# EAGLE design REF-IN-BLE-NS 4-1 (EAGLE 7.7.0)
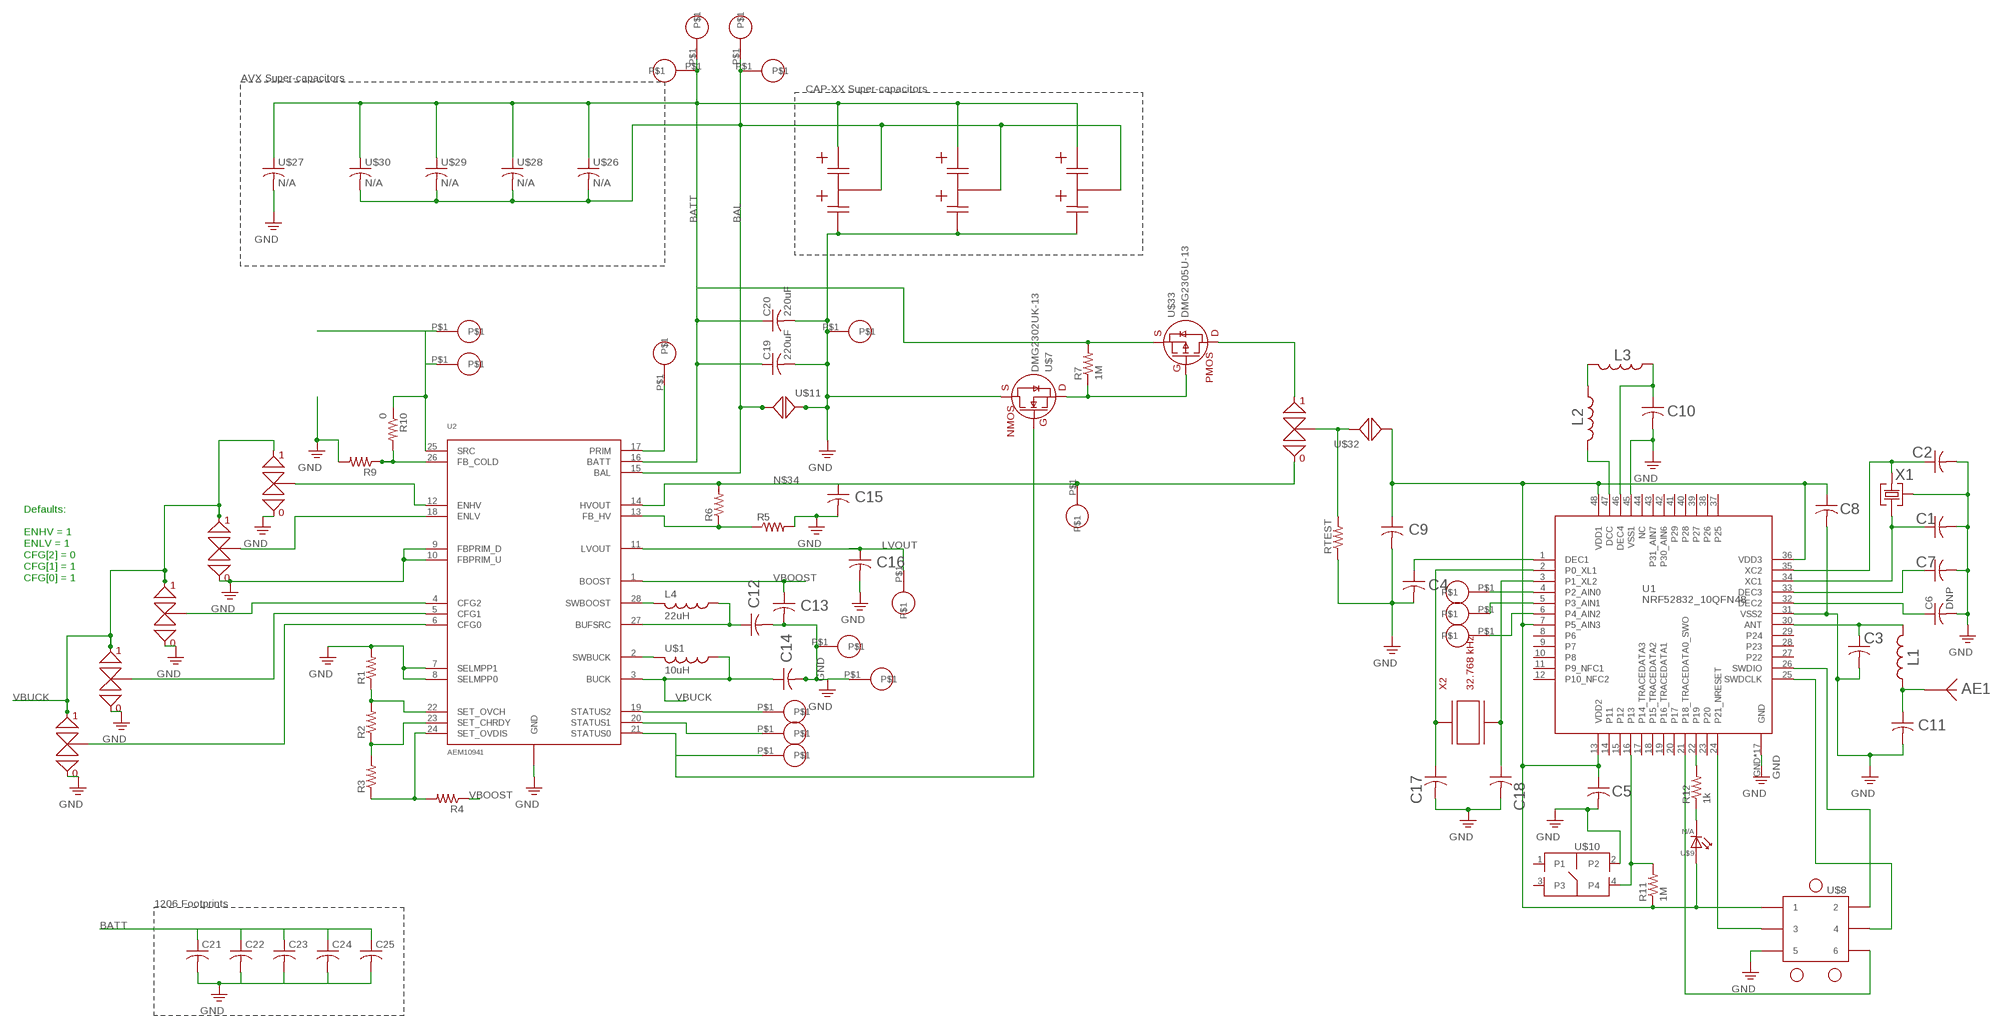
[diagram p0: schematic, sheet 1]

## Parts
AE1  N/A  2.4GHZ_ANTENNA  [BLE_ANTENNA_NORDIC]
C1  12pF  C-UST-12PFC0603  [C0603]
C2  12pF  C-UST-12PFC0603  [C0603]
C3  0.8pF  C-UST-0.8PFC0603  [C0603]
C4  100nF  C-UST-100NFC0603  [C0603]
C5  100nF  C-UST-100NFC0603  [C0603]
C6  DNP  C-USC0603  [C0603]
C7  100pF  C-UST-100PFC0603  [C0603]
C8  100nF  C-UST-100NFC0603  [C0603]
C9  4.7uF  C-UST-4.7UFC0603  [C0603]
C10  1uF  C-UST-1UFC0603  [C0603]
C11  DNP  C-USC0603  [C0603]
C12  10uF  C-UST-10UFC0603  [C0603]
C13  22uF  C-UST-22UFC0603  [C0603]
C14  10uF  C-UST-10UFC0603  [C0603]
C15  10uF  C-UST-10UFC0603  [C0603]
C16  10uF  C-UST-10UFC0603  [C0603]
C17  12pF  C-UST-12PFC0603  [C0603]
C18  12pF  C-UST-12PFC0603  [C0603]
C19  220uF  C-UST-220UFC1206  [C1206]
C20  220uF  C-UST-220UFC1206  [C1206]
C21  C-USC1206  [C1206]
C22  C-USC1206  [C1206]
C23  C-USC1206  [C1206]
C24  C-USC1206  [C1206]
C25  C-USC1206  [C1206]
L1  3.9nH  L0603V-3.9NH  [L0603]
L2  10uH  L0603V-10UH  [L0603]
L3  15nH  L0603V-15NH  [L0603]
L4  22uH  744031220  [744031220]
R1  R-US_R0603  [R0603]
R2  R-US_R0603  [R0603]
R3  R-US_R0603  [R0603]
R4  R-US_R0603  [R0603]
R5  R-US_R0603  [R0603]
R6  R-US_R0603  [R0603]
R7  1M  R-US_R0603  [R0603]
R9  R-US_R0603  [R0603]
R10  0  R-US_R0603  [R0603]
R11  1M  R-US_R0603  [R0603]
R12  1k  R-US_R0603  [R0603]
RTEST  R-US_R0603  [R0603]
U1  NRF52832_10QFN48  [NRF52832_10]
U2  AEM10941  [QFN28_5X5_05PITCH]
U$1  10uH  L0603V-10UH  [L0603]
U$2  DOUBLE_SOLDER_BRIDGE1_CLOSED  [DOUBLE_SOLDER_BRIDGE_1_CLOSED]
U$3  DOUBLE_SOLDER_BRIDGE1_CLOSED  [DOUBLE_SOLDER_BRIDGE_1_CLOSED]
U$4  N/A  DOUBLE_SOLDER_BRIDGE0_CLOSED  [DOUBLE_SOLDER_BRIDGE_0_CLOSED]
U$5  DOUBLE_SOLDER_BRIDGE1_CLOSED  [DOUBLE_SOLDER_BRIDGE_1_CLOSED]
U$6  DOUBLE_SOLDER_BRIDGE1_CLOSED  [DOUBLE_SOLDER_BRIDGE_1_CLOSED]
U$7  DMG2302UK-13  [SOT-23-3-DIODESINC]
U$8  N/A  TC2030-IDC  [TC2030-IDC]
U$9  N/A  APT1608LZGCK  [APT1608LZGCK]
U$10  MJTP1140  [MJTP1140A]
U$11  SOLDER_BRIGDECLOSED  [SOLDER_BRIDGE_CLOSED]
U$12  N/A  1MM_PAD  [1MM_PAD]
U$13  N/A  1MM_PAD  [1MM_PAD]
U$14  N/A  1MM_PAD  [1MM_PAD]
U$15  N/A  1MM_PAD  [1MM_PAD]
U$16  N/A  1MM_PAD  [1MM_PAD]
U$17  N/A  1MM_PAD  [1MM_PAD]
U$18  N/A  1MM_PAD  [1MM_PAD]
U$19  N/A  1MM_PAD  [1MM_PAD]
U$20  N/A  1MM_PAD  [1MM_PAD]
U$21  N/A  1MM_PAD  [1MM_PAD]
U$22  N/A  1MM_PAD  [1MM_PAD]
U$23  N/A  CAP-XX_A-TYPE  [CAP-XX_A-TYPE]
U$24  N/A  CAP-XX_S-TYPE  [CAP-XX_S-TYPE]
U$25  N/A  CAP-XX_W-TYPE  [CAP-XX_W-TYPE]
U$26  N/A  BZ01_L-TYPE  [BZ01_L-TYPE]
U$27  N/A  BZ059_N-TYPE  [BZ059_N-TYPE]
U$28  N/A  BZ01_S-TYPE  [BZ01_S-TYPE]
U$29  N/A  BZ05_S-TYPE  [BZ05_S-TYPE]
U$30  N/A  BZ09_S-TYPE  [BZ09_S-TYPE]
U$31  DOUBLE_SOLDER_BRIDGE1_CLOSED  [DOUBLE_SOLDER_BRIDGE_1_CLOSED]
U$32  SOLDER_BRIGDECLOSED  [SOLDER_BRIDGE_CLOSED]
U$33  DMG2305U-13  [SOT-23-3-DIODESINC]
U$35  N/A  1MM_PAD  [1MM_PAD]
U$36  N/A  1MM_PAD  [1MM_PAD]
U$37  N/A  1MM_PAD  [1MM_PAD]
U$38  N/A  1MM_PAD  [1MM_PAD]
U$39  N/A  1MM_PAD  [1MM_PAD]
U$40  N/A  1MM_PAD  [1MM_PAD]
U$41  N/A  1MM_PAD  [1MM_PAD]
X1  32 MHz  FA-128-32MHZMF10Z-AJ5  [FA-128-EPSON]
X2  32.768 kHz  FC-135_32.7680KA-AC  [FC-135]

## Nets
BAL: U2.15(BAL) U$11.P$1(P1) U$19.P$1 U$23.P$1(BAL) U$24.P$1(BAL) U$25.P$1(BAL) U$26.P$3 U$26.P$4 U$28.P$3 U$29.P$3 U$30.P$3 U$41.P$1
BATT: C19.1 C20.1 C21.1 C22.1 C23.1 C24.1 C25.1 R7.2 U2.16(BATT) U$18.P$1 U$23.P$2(+) U$24.P$2(+) U$25.P$2(+) U$26.P$1 U$26.P$2 U$27.P$1 U$28.P$1 U$28.P$2 U$29.P$1 U$29.P$2 U$30.P$1 U$30.P$2 U$33.2(S) U$40.P$1
GND: C1.2 C2.2 C3.2 C4.2 C5.2 C6.2 C7.2 C8.2 C9.2 C10.2 C11.2 C12.2 C13.2 C14.2 C15.2 C16.2 C17.2 C18.2 C19.2 C20.2 C21.2 C22.2 C23.2 C24.2 C25.2 R1.2 R5.2 R9.2 RTEST.1 U1.31(VSS2) U1.45(VSS1) U1.GND U1.P$2(GND) U1.P$3(GND) U1.P$4(GND) U1.P$5(GND) U1.P$6(GND) U1.P$7(GND) U1.P$8(GND) U1.P$9(GND) U1.P$10(GND) U1.P$11(GND) U1.P$12(GND) U1.P$13(GND) U1.P$14(GND) U1.P$15(GND) U1.P$16(GND) U1.P$17(GND) U2.7(SELMPP1) U2.8(SELMPP0) U2.9(FBPRIM_D) U2.10(FBPRIM_U) U2.GND U2.GND1(GND) U2.GND2(GND) U2.GND3(GND) U2.GND4(GND) U2.GND5(GND) U$2.IN0 U$3.IN0 U$4.IN0 U$5.IN0 U$6.IN0 U$7.2(S) U$8.P5 U$10.2 U$11.P$2(P2) U$17.P$1 U$23.P$3(-) U$24.P$3(-) U$25.P$3(-) U$27.P$2 U$35.P$1 U$38.P$1 X1.P2(P3) X1.P4(P3)
HVOUT: C5.1 C8.1 C9.1 R11.1 U1.7(P5_AIN3) U1.13(VDD2) U1.36(VDD3) U1.48(VDD1) U$8.P1 U$9.A U$32.P$1(P1)
LVOUT: C16.1 U2.11(LVOUT) U$16.P$1
N$1: L2.2 U1.47(DCC)
N$2: L2.1 L3.2
N$3: C10.1 L3.1 U1.46(DEC4)
N$5: C4.1 U1.1(DEC1)
N$6: C2.1 U1.35(XC2) X1.P1
N$7: C1.1 U1.34(XC1) X1.P3
N$8: C3.1 L1.2 U1.30(ANT)
N$9: AE1.P$1 C11.1 L1.1
N$10: C7.1 U1.33(DEC3)
N$11: C6.1 U1.32(DEC2)
N$12: L4.PIN2 U2.28(SWBOOST)
N$13: C12.1 L4.PIN1 U2.27(BUFSRC)
N$14: R1.1 R2.2 U2.22(SET_OVCH)
N$15: U2.2(SWBUCK) U$1.2
N$16: R2.1 R3.2 U2.23(SET_CHRDY)
N$17: R11.2 U1.16(P13) U$10.4
N$18: R3.1 R4.2 U2.24(SET_OVDIS)
N$19: U2.4(CFG2) U$4.OUT
N$20: U2.18(ENLV) U$3.OUT
N$21: U1.25(SWDCLK) U$8.P4
N$22: U1.24(P21_NRESET) U$8.P3
N$23: U2.12(ENHV) U$2.OUT
N$24: U1.26(SWDIO) U$8.P2
N$25: U1.21(P18_TRACEDATA0_SWO) U$8.P6
N$26: U2.5(CFG1) U$5.OUT
N$27: U2.6(CFG0) U$6.OUT
N$28: R5.1 R6.1 U2.13(FB_HV)
N$29: R10.1 U2.25(SRC) U$36.P$1 U$39.P$1
N$30: R12.1 U$9.C
N$31: R12.2 U1.22(P19)
N$32: R9.1 R10.2 U2.26(FB_COLD)
N$34: C15.1 R6.2 U2.14(HVOUT) U$31.IN0 U$37.P$1
N$36: C17.1 U1.2(P0_XL1) X2.P$1
N$37: C18.1 U1.3(P1_XL2) X2.P$2
N$38: U1.4(P2_AIN0) U$20.P$1
N$42: U1.5(P3_AIN1) U$21.P$1
N$43: U1.6(P4_AIN2) U$22.P$1
N$45: RTEST.2 U$31.OUT U$32.P$2(P2)
N$46: U$31.IN1 U$33.3(D)
N$47: R7.1 U$7.3(D) U$33.1(G)
PRIM: U2.17(PRIM) U$12.P$1
STATUS0: U2.21(STATUS0) U$7.1(G) U$15.P$1
STATUS1: U2.20(STATUS1) U$14.P$1
STATUS2: U2.19(STATUS2) U$13.P$1
VBOOST: C13.1 R4.1 U2.1(BOOST)
VBUCK: C14.1 U2.3(BUCK) U$1.1 U$2.IN1 U$3.IN1 U$4.IN1 U$5.IN1 U$6.IN1
Unconnected: U1.8(P6) U1.9(P7) U1.10(P8) U1.11(P9_NFC1) U1.12(P10_NFC2) U1.14(P11) U1.15(P12) U1.17(P14_TRACEDATA3) U1.18(P15_TRACEDATA2) U1.19(P16_TRACEDATA1) U1.20(P17) U1.23(P20) U1.27(P22) U1.28(P23) U1.29(P24) U1.37(P25) U1.38(P26) U1.39(P27) U1.40(P28) U1.41(P29) U1.42(P30_AIN6) U1.43(P31_AIN7) U1.44(NC) U$10.1 U$10.3

## Notes on the sheet
- AVX Super-capacitors
- CAP-XX Super-capacitors
- Defaults:
  
  ENHV = 1
  ENLV = 1
  CFG[2] = 0
  CFG[1] = 1
  CFG[0] = 1
- 1206 Footprints

## Library data of the parts
AE1 = 00_PF_Nordic:2.4GHZ_ANTENNA; MFG_PART#: N/A; PERCENTAGE: N/A
C1 C2 C17 C18 = resistor:C-US: CAPACITOR, American symbol; MFG_PART#: C0603C120J5GACTU; PERCENTAGE: 5%
C3 = resistor:C-US: CAPACITOR, American symbol; MFG_PART#: CBR06C808B5GAC; PERCENTAGE: 5%
C4 C5 C8 = resistor:C-US: CAPACITOR, American symbol; MFG_PART#: CL10B104KB8NNNC; PERCENTAGE: 10%
C6 C11 C21-C25 = resistor:C-US: CAPACITOR, American symbol
C7 = resistor:C-US: CAPACITOR, American symbol; MFG_PART#: CL10C101JB8NNNC; PERCENTAGE: 5%
C9 = resistor:C-US: CAPACITOR, American symbol; MFG_PART#: CL10A475KQ8NNWC; PERCENTAGE: 5%
C10 = resistor:C-US: CAPACITOR, American symbol; MFG_PART#: CL10A105KP8NNNC; PERCENTAGE: 10%
C12 C14-C16 = resistor:C-US: CAPACITOR, American symbol; MFG_PART#: GRM188R61E106MA73D; PERCENTAGE: 20%
C13 = resistor:C-US: CAPACITOR, American symbol; MFG_PART#: GRM188R61A226ME15D; PERCENTAGE: 20%
C19 C20 = resistor:C-US: CAPACITOR, American symbol; MFG_PART#: GRM31CC80G227ME11L
L1 = 00_PF_Nordic:L0603; MFG_PART#: L-14C3N9SV4T; PERCENTAGE: 5%
L2 U$1 = 00_PF_Nordic:L0603; MFG_PART#: LBR2012T100M; PERCENTAGE: 20%
L3 = 00_PF_Nordic:L0603; MFG_PART#: L-14C15NJV4T; PERCENTAGE: 10%
L4 = 00_PF_Nordic:744031220: Wurth inductor 22uH; MFG_PART#: 744031220; PERCENTAGE: 30%
R1-R7 R9-R12 RTEST = resistor:R-US_: RESISTOR, American symbol
U1 = 00_PF_Nordic:NRF52832_10QFN48; MFG_PART#: NRF52832-QFAA-R
U2 = 00_PF_Nordic:AEM10941: AEM10941 ? Energy Harvesting Power Management IC; MFG_PART#: AEM10941-QFN
U$2 U$3 U$5 U$6 U$31 = 00_PF_Nordic:DOUBLE_SOLDER_BRIDGE
U$4 = 00_PF_Nordic:DOUBLE_SOLDER_BRIDGE; MFG_PART#: N/A; PERCENTAGE: N/A
U$7 = 00_PF_Nordic:DMG2302UK-13
U$8 = 00_PF_Nordic:TC2030-IDC; MFG_PART#: N/A; PERCENTAGE: N/A
U$9 = 00_PF_Nordic:APT1608LZGCK; MFG_PART#: APT1608LZGCK; PERCENTAGE: N/A
U$10 = 00_PF_Nordic:MJTP1140; MFG_PART#: TL3315NF100Q
U$11 U$32 = 00_PF_Nordic:SOLDER_BRIGDE
U$12-U$22 U$35-U$41 = 00_PF_Nordic:1MM_PAD; MFG_PART#: N/A; PERCENTAGE: N/A
U$23 = 00_PF_Nordic:CAP-XX_A-TYPE; MFG_PART#: N/A; PERCENTAGE: N/A
U$24 = 00_PF_Nordic:CAP-XX_S-TYPE; MFG_PART#: N/A; PERCENTAGE: N/A
U$25 = 00_PF_Nordic:CAP-XX_W-TYPE; MFG_PART#: N/A; PERCENTAGE: N/A
U$26 = 00_PF_Nordic:BZ01_L-TYPE; MFG_PART#: N/A; PERCENTAGE: N/A
U$27 = 00_PF_Nordic:BZ059_N-TYPE; MFG_PART#: N/A; PERCENTAGE: N/A
U$28 = 00_PF_Nordic:BZ01_S-TYPE; MFG_PART#: N/A; PERCENTAGE: N/A
U$29 = 00_PF_Nordic:BZ05_S-TYPE; MFG_PART#: N/A; PERCENTAGE: N/A
U$30 = 00_PF_Nordic:BZ09_S-TYPE; MFG_PART#: N/A; PERCENTAGE: N/A
U$33 = 00_PF_Nordic:DMG2305U-13
X1 = 00_PF_Nordic:FA-128-32MHZMF10Z-AJ5; MFG_PART#: FA-128 32.0000MF10Z-AJ3; PERCENTAGE: 10 ppm
X2 = 00_PF_Nordic:FC-135_32.7680KA-AC; MFG_PART#: FC-135 32.7680KA-AC

## Board
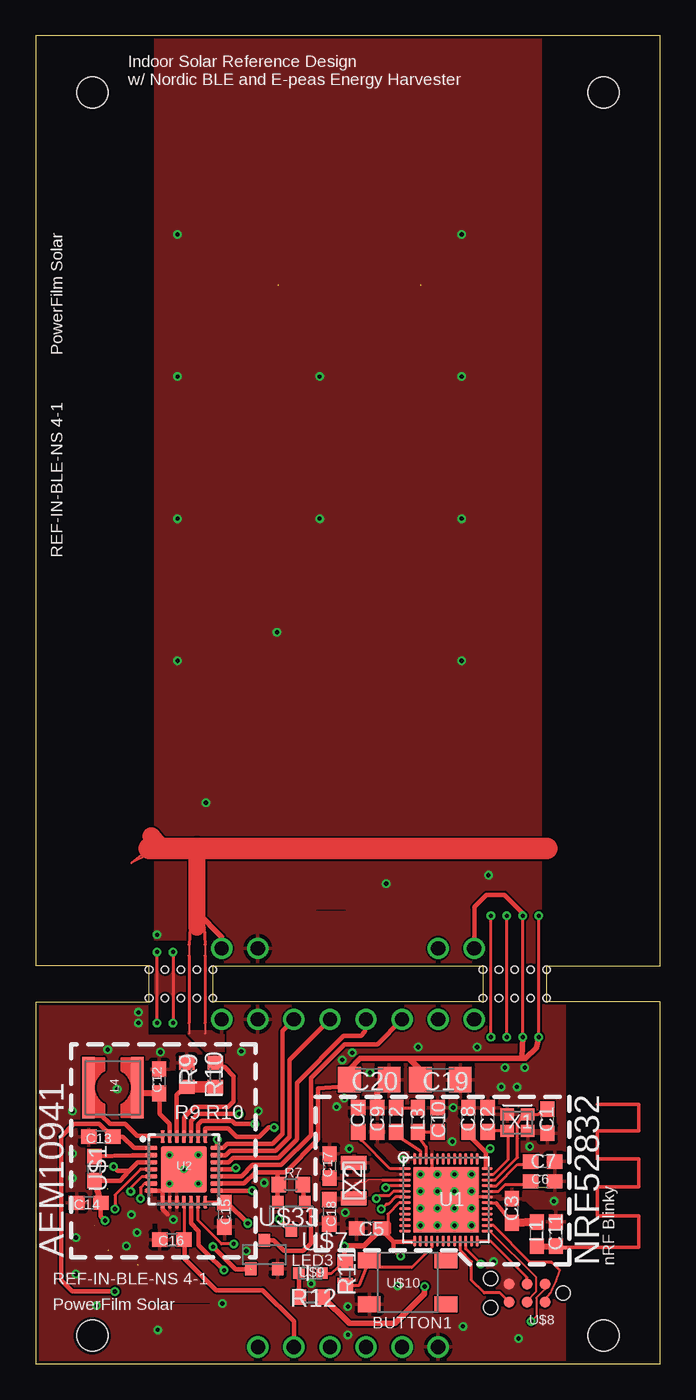
[diagram p1: board, top side]
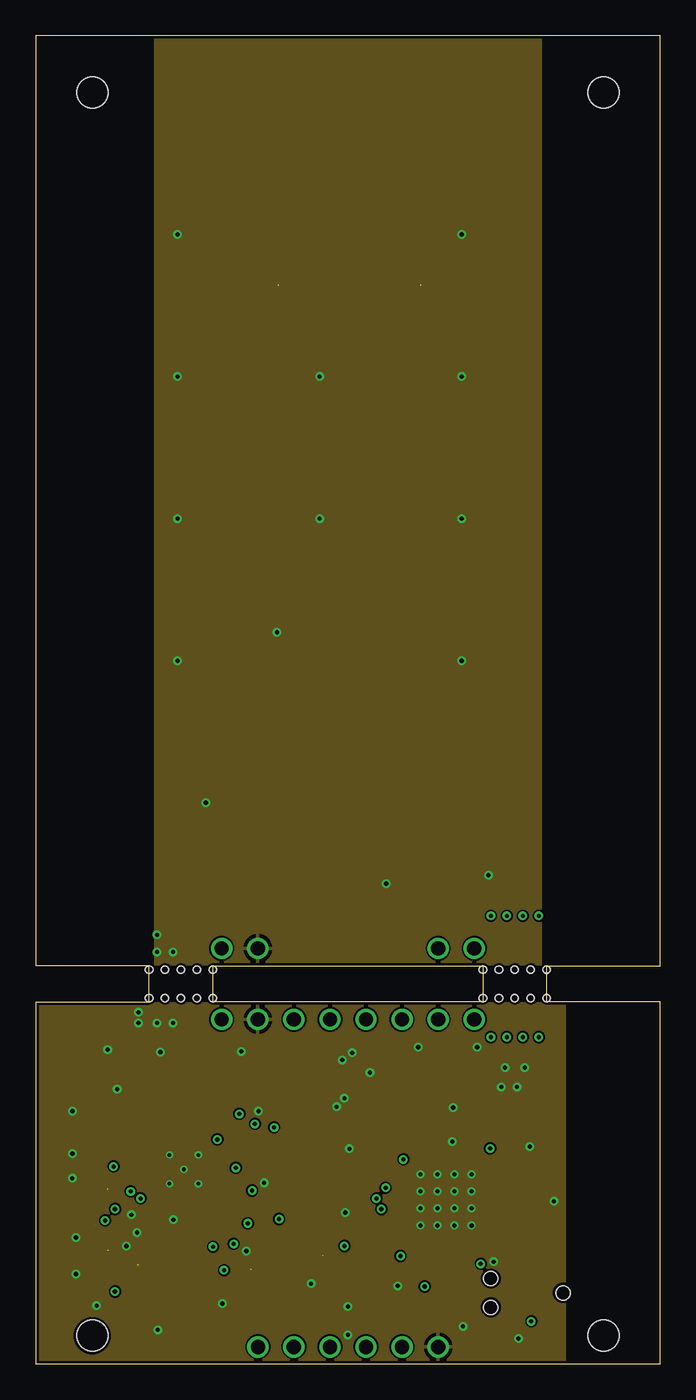
[diagram p2: board, inner layer Route2]
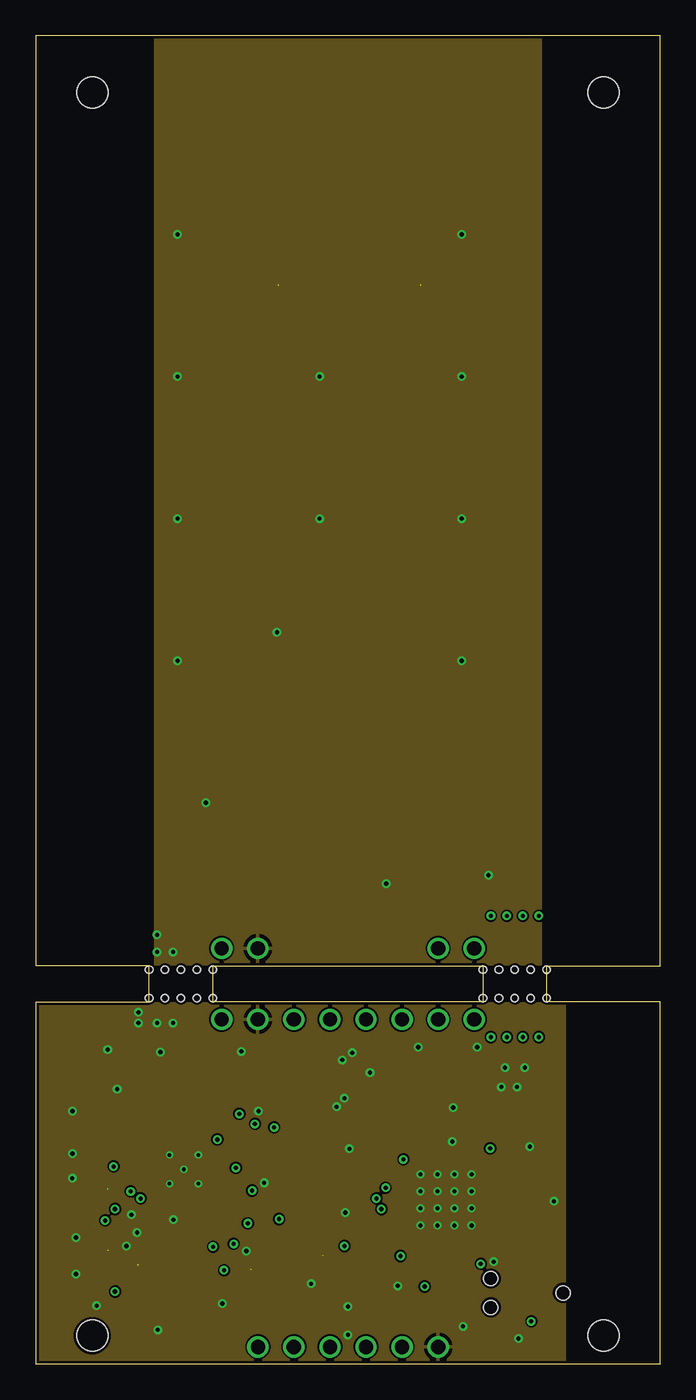
[diagram p3: board, inner layer Route15]
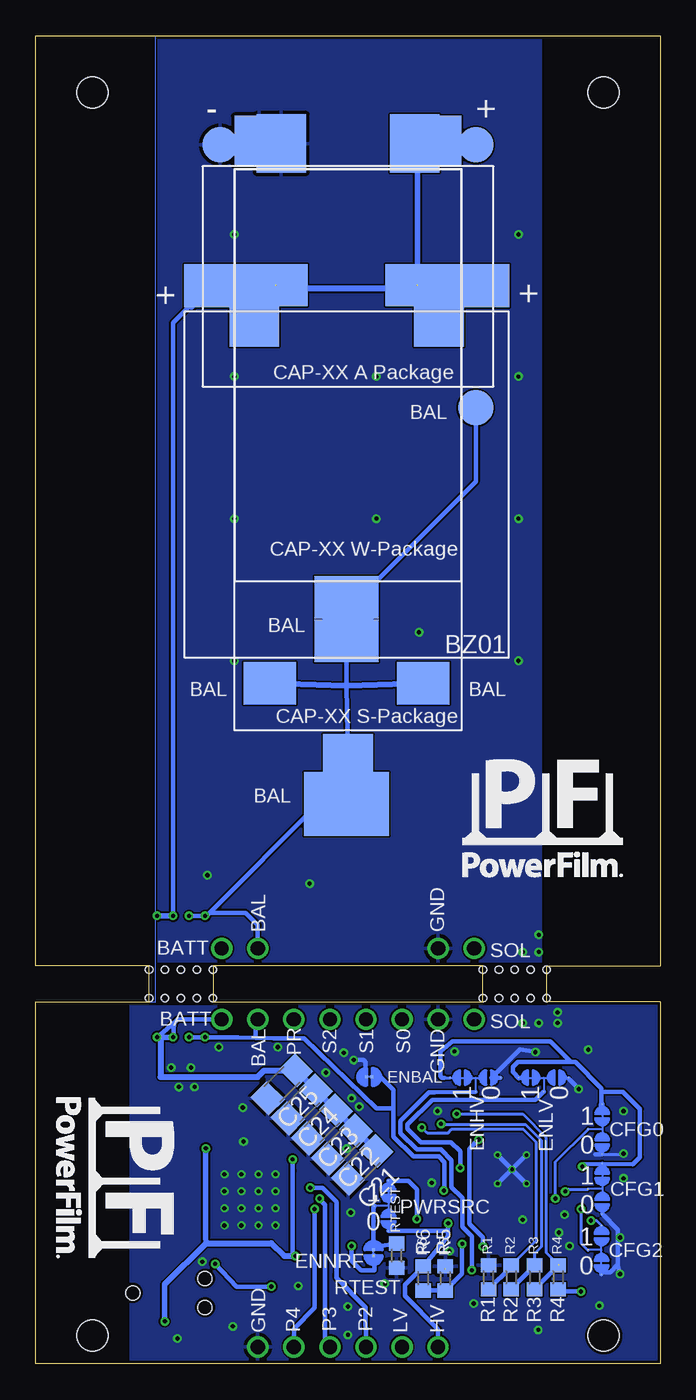
[diagram p4: board, bottom side, seen from below]

Size 44 x 93.5 mm. Coordinates in mm from the lower left corner, seen from the top.
Outline: 0,0 44,0 44,25.5 36,25.5 36,28 44,28 44,93.5 0,93.5 0,28 8,28 8,25.5 0,25.5 0,0
Outline: 12.5,28 31.5,28 31.5,25.5 12.5,25.5 12.5,28
Copper layers (1*2+15*16): Top 0.035559375mm / dielectric 1.6mm / Route2 0.0356mm / dielectric 0.1499mm / Route15 0.0356mm / dielectric 0.2007mm / Bottom 0.035559375mm
Design rules "jlcpcb2layer *": minimum track width 5mil, minimum drill 0.2mm, track to track 5mil, track to pad 5mil, pad to pad 5mil, via to via 5mil, smd to smd 5mil, copper to edge 8mil, drill to drill 6mil, minimum pad ring 5mil, minimum via ring 3mil, stop-mask expansion 2.5mil, vias tented up to drill 0.3mm, thermal gap 10mil
Holes 2.2 mm at 4,2 40,2 4,89.5 40,89.5
Holes 0.5 mm at 8,27.75 9.12,27.75 10.25,27.75 11.38,27.75 12.5,27.75 8,25.75 9.12,25.75 10.25,25.75 11.38,25.75 12.5,25.75 36,27.75 34.88,27.75 33.75,27.75 32.62,27.75 31.5,27.75 31.5,25.75 32.62,25.75 33.75,25.75 34.88,25.75 36,25.75
tRestrict: area 26.5,9.2 to 26.6,13.9; area 26.6,13.9 to 27.7,14; area 28.1,13.9 to 31.2,14; area 31.2,12 to 31.4,13.9; area 26.6,9.1 to 31.2,9.2; area 8.7,13.5 to 8.8,13.9; area 10.2,15.3 to 10.7,15.4; area 12.1,13.5 to 12.2,13.9; area 10.2,12 to 10.7,12.1; area 22.1,16.9 to 23.3,17.4; area 24.8,16.9 to 28.9,17.4; area 29.9,16.9 to 32.4,17.4; 8 more areas; 4 lines
bRestrict: 4 lines

### Footprints (pad centres in the part's own frame; a part is rotated, then mirrored left to right if it is on the bottom)
BLE_ANTENNA_NORDIC = smd 0.254 x 0.254: P$1 0,0.13
C0603 = smd 1.1 x 1: 1 -0.85,0; 2 0.85,0
C1206 = smd 1.6 x 1.8: 1 -1.4,0; 2 1.4,0
L0603 = smd 1.1 x 1: 1 -0.85,0; 2 0.85,0
744031220 = smd 4.3 x 0.85: PIN1 0,1.725; PIN2 0,-1.725
R0603 = smd 1 x 1.1: 1 -0.85,0; 2 0.85,0
NRF52832_10 = smd 0.8 x 0.2: 1 -2.9,2.2; 2 -2.9,1.8; 3 -2.9,1.4; 4 -2.9,1; 5 -2.9,0.6; 6 -2.9,0.2; 7 -2.9,-0.2; 8 -2.9,-0.6; 9 -2.9,-1; 10 -2.9,-1.4; 11 -2.9,-1.8; 12 -2.9,-2.2; 25 2.9,-2.2; 26 2.9,-1.8; 27 2.9,-1.4; 28 2.9,-1; 29 2.9,-0.6; 30 2.9,-0.2; 31 2.9,0.2; 32 2.9,0.6; 33 2.9,1; 34 2.9,1.4; 35 2.9,1.8; 36 2.9,2.2 | smd 0.2 x 0.8: 13 -2.2,-2.9; 14 -1.8,-2.9; 15 -1.4,-2.9; 16 -1,-2.9; 17 -0.6,-2.9; 18 -0.2,-2.9; 19 0.2,-2.9; 20 0.6,-2.9; 21 1,-2.9; 22 1.4,-2.9; 23 1.8,-2.9; 24 2.2,-2.9; 37 2.2,2.9; 38 1.8,2.9; 39 1.4,2.9; 40 1,2.9; 41 0.6,2.9; 42 0.2,2.9; 43 -0.2,2.9; 44 -0.6,2.9; 45 -1,2.9; 46 -1.4,2.9; 47 -1.8,2.9; 48 -2.2,2.9 | smd 4.6 x 4.6: GND 0,0 | drill 0.3 pad 0.5: P$2 -0.6,-0.6; P$3 -1.8,-0.6; P$4 0.6,-0.6; P$5 1.8,-0.6; P$6 -1.8,-1.8; P$7 -0.6,-1.8; P$8 0.6,-1.8; P$9 1.8,-1.8; P$10 -1.8,0.6; P$11 -0.6,0.6; P$12 0.6,0.6; P$13 1.8,0.6; P$14 1.8,1.8; P$15 0.6,1.8; P$16 -0.6,1.8; P$17 -1.8,1.8
QFN28_5X5_05PITCH = smd 0.9 x 0.3: 1 -2.3,1.5; 2 -2.3,1; 3 -2.3,0.5; 4 -2.3,0; 5 -2.3,-0.5; 6 -2.3,-1; 7 -2.3,-1.5; 15 2.3,-1.5; 16 2.3,-1; 17 2.3,-0.5; 18 2.3,0; 19 2.3,0.5; 20 2.3,1; 21 2.3,1.5 | smd 0.3 x 0.9: 8 -1.5,-2.3; 9 -1,-2.3; 10 -0.5,-2.3; 11 0,-2.3; 12 0.5,-2.3; 13 1,-2.3; 14 1.5,-2.3; 22 1.5,2.3; 23 1,2.3; 24 0.5,2.3; 25 0,2.3; 26 -0.5,2.3; 27 -1,2.3; 28 -1.5,2.3 | smd 3.25 x 3.25: GND 0,0 | drill 0.25: GND1 0,0; GND2 1.016,1.016; GND3 1.016,-1.016; GND4 -1.016,-1.016; GND5 -1.016,1.016
DOUBLE_SOLDER_BRIDGE_1_CLOSED = smd 0.127 x 0.127: IN0 0.05,0.106; IN1 0.05,3.644; OUT -0.938,1.875
DOUBLE_SOLDER_BRIDGE_0_CLOSED = smd 0.127 x 0.127: IN0 0,0.156; IN1 0,3.594; OUT -0.938,1.875
SOT-23-3-DIODESINC = smd 0.8 x 0.9: 1 -0.95,-1; 2 0.95,-1; 3 0,1
TC2030-IDC = smd 0.787 x 0.787: P1 -1.27,-0.635; P2 -1.27,0.635; P3 0,-0.635; P4 0,0.635; P5 1.27,-0.635; P6 1.27,0.635 | hole 0.991: -2.54,0; 2.54,1.016; 2.54,-1.016
APT1608LZGCK = smd 0.8 x 0.8: A 0.825,0; C -0.825,0
MJTP1140A = smd 1.6 x 1.1: 1 -2.7,1.55; 2 2.7,1.55; 3 -2.7,-1.55; 4 2.7,-1.55
SOLDER_BRIDGE_CLOSED = smd 0.203 x 0.203: P$1 -0.203,0; P$2 0.203,0
1MM_PAD = drill 1: P$1 0,0
CAP-XX_A-TYPE = smd 2.5 x 2.5: P$1 0,0; P$2 18.5,0; P$3 18.5,18
CAP-XX_S-TYPE = smd 3.5 x 3.5: P$1 0,0; P$2 43.5,-6.25; P$3 43.5,6.25
CAP-XX_W-TYPE = smd 3.5 x 3.5: P$1 0,0; P$2 33,-6.25; P$3 33,6.25
BZ01_L-TYPE = smd 3 x 3.7: P$1 0,0; P$2 0,19.2; P$3 28,15; P$4 28,4.2
BZ059_N-TYPE = smd 4.1 x 3.5: P$1 0,0; P$2 0,9.4
BZ01_S-TYPE = smd 5.8 x 3.5: P$1 0,0; P$2 0,13 | smd 4.5 x 6: P$3 35.1,6.5
BZ05_S-TYPE = smd 2.9 x 4.5: P$1 0,0; P$2 0,10 | smd 3 x 4.5: P$3 25,5
BZ09_S-TYPE = smd 2.9 x 4.5: P$1 0,0; P$2 0,10 | smd 3 x 4.5: P$3 22,5
FA-128-EPSON = smd 0.95 x 0.85: P1 -0.725,-0.575; P2 0.725,-0.575; P3 0.725,0.575; P4 -0.725,0.575
FC-135 = smd 1 x 1.8: P$1 0,0; P$2 2.5,0

### Placement (x,y rotation side)
AE1  37.14,8.2 270 top
C1  36.04,17.09 270 top
C2  31.84,17.19 90 top
C3  33.54,10.79 90 top
C4  22.72,17.19 90 top
C5  23.46,9.54 180 top
C6  35.7,12.86 0 top
C7  35.7,14.25 0 top
C8  30.47,17.19 90 top
C9  24.06,17.19 90 top
C10  28.31,17.19 90 top
C11  36.64,9.14 90 top
C12  8.7,19.9 90 top
C13  4.6,16 180 top
C14  3.75,11.35 180 top
C15  13.3,10.5 270 top
C16  9.6,8.75 180 top
C17  20.71,13.93 90 top
C18  20.69,10.72 270 top
C19  28.5,20 0 top
C20  23.5,20 0 top
C21  21,14.02 225 bottom
C22  22.41,15.44 225 bottom
C23  23.83,16.85 225 bottom
C24  25.24,18.27 225 bottom
C25  26.66,19.68 225 bottom
L1  35.29,9.14 90 top
L2  25.39,17.19 270 top
L3  26.93,17.19 90 top
L4  5.45,19.45 270 top
R1  12.1,6.1 90 bottom
R2  10.5,6.1 90 bottom
R3  8.85,6.1 90 bottom
R4  7.2,6.1 90 bottom
R5  15.15,6.03 90 bottom
R6  16.7,6.03 90 bottom
R7  17.98,12.62 180 top
R9  10.65,20.35 90 top
R10  12.65,20.35 270 top
R11  21.8,6.4 270 top
R12  19.4,4.7 0 top
RTEST  18.57,7.62 90 bottom
U1  28.9,11.55 0 top
U2  10.45,13.7 0 top
U$1  4.15,13.75 90 top
U$2  11.15,20.1 90 bottom
U$3  6.35,20.1 90 bottom
U$4  4.15,6.15 0 bottom
U$5  4.15,10.45 0 bottom
U$6  4.15,14.65 0 bottom
U$7  16.1,7.7 0 top
U$8  34.6,5 180 top
U$9  19.35,6.4 0 top
U$10  26.2,5.75 180 top
U$11  20.5,20.2 180 bottom
U$12  25.81,24.25 0 top
U$13  23.27,24.25 0 top
U$14  20.73,24.25 0 top
U$15  18.19,24.25 0 top
U$16  18.19,1.2 0 top
U$17  15.65,29.25 0 top
U$18  30.89,24.25 0 top
U$19  28.35,24.25 0 top
U$20  20.73,1.2 0 top
U$21  23.27,1.2 0 top
U$22  25.81,1.2 0 top
U$23  13,67.3 90 bottom
U$24  22,42.6 90 bottom
U$25  22,53.1 90 bottom
U$26  31.7,75.9 270 bottom
U$27  17.3,85.9 90 bottom
U$28  28.6,74.5 270 bottom
U$29  27.1,75.9 270 bottom
U$30  27.1,75.95 270 bottom
U$31  19.2,9.25 0 bottom
U$32  20.2,7.83 90 bottom
U$33  18,10.4 180 top
U$35  15.65,24.25 0 top
U$36  13.11,24.25 0 top
U$37  15.66,1.2 0 top
U$38  28.35,1.2 0 top
U$39  13.11,29.25 0 top
U$40  30.89,29.25 0 top
U$41  28.35,29.25 0 top
X1  33.94,16.99 0 top
X2  22.41,14.15 270 top

### Tracks (layer width: path | path; a pad name or v marks a point on that pad's centre or on a via)
BAL  (via drill 0.3 pad 0.6)
  Top 0.2: v32.06,23 v32.06,31.54 | v33.19,23 v33.19,31.54
  Top 0.3: U2.15 v15.25,12.2
  Bottom 0.254: 19.7,20.2 U$11.P$1
  Bottom 0.3: v15.25,12.2 15.2,12.25 15.2,14.2 15.6,14.6 17.4,14.6 18.8,16 18.8,18 | 18.8,18 18.8,19.3 19.7,20.2 | U$24.P$1 22.1,47.7 U$29.P$3 | U$23.P$1 13,62.1 U$25.P$1 | v33.19,23 v32.06,23 29.75,23 28.5,22.95 | v33.19,31.54 v32.06,31.54 32.06,31.44 31.75,31.75 | 18.8,18 20,18 25.1,22.9 27.25,22.9 28.5,22.95 | 28.5,22.95 28.5,24.1 U$19.P$1 | 31.75,31.75 24.1,39.4 U$28.P$3 | U$41.P$1 28.35,30.89 29.21,31.75 31.75,31.75
  Bottom 0.406: U$26.P$3 22.1,47.7 U$26.P$4 | U$30.P$3 U$25.P$1 U$29.P$3 | U$24.P$1 22.1,40.2 22.3,40 22.3,39.5 U$28.P$3
BATT  (via drill 0.3 pad 0.6)  (2 unrouted)
  Top 0.2: v34.31,23 v34.31,31.54 | v35.44,23 v35.44,31.54
  Top 0.3: U2.16 14.7,12.7 15.5,13.5 17.15,13.5 17.6,13.5 19.9,15.8 19.9,19.4 21.75,19.55 | 22.9,21.5 22.85,21.5 | C19.1 27,20 | v34.31,31.54 34.31,31.73 33.02,33.02 31.75,33.02 30.89,32.16 U$40.P$1
  Top 0.305: U$33.2 17.05,12.65 | 17.05,12.65 17.05,13.4 17.15,13.5 | R7.2 17.07,12.62 17.05,12.65
  Top 0.4: 21.75,19.55 21.75,19.65 C20.1 22.1,20.75 22.85,21.5 | 27,20 27,20.8 26.3,21.5 | 26.3,21.5 22.9,21.5 | 26.3,21.5 34.5,21.5 35.25,22.25 v35.44,23 | v34.31,23 34.25,21.6
  Bottom 0.3: U$25.P$2 15.3,86.1 13.5,86.1 U$23.P$2 | U$18.P$1 34,24.25 34.25,24 | 34.25,24 v35.44,23 | v34.31,23 34.25,24 | v34.31,31.54 34.31,73.29 U$26.P$1
  Bottom 0.4: v35.44,23 35.2,23 v34.31,23 | v34.31,31.54 v35.44,31.54 | 33,74.4 U$26.P$1 | U$30.P$2 17.1,85.7 U$27.P$1
  Bottom 0.406: U$26.P$2 16.6,75.7 | 16.6,75.7 28.4,75.7 | 28.4,75.7 U$26.P$1 | U$27.P$1 15.5,85.9 15.3,86.1 | U$30.P$2 16.8,75.9 16.6,75.7 | 16.6,75.7 16.6,75.4 U$28.P$2 | U$28.P$1 28.3,74.8 28.3,75.6 | 28.3,75.6 28.4,75.7 | 28.3,75.6 27.4,75.6 U$30.P$1 | C21.1 C22.1 C23.1 C24.1 C25.1 27.9,20.65 28.35,20.2 35.2,20.2 35.2,23
GND  (via drill 0.3 pad 0.6)
  Top 0.2: U1.45 27.9,13.75 | U1.31 31.1,11.75 | v9.69,29 v9.69,24 | v8.56,24 v8.56,29
  Top 0.3: 8.95,12.2 U2.8 8.95,10.9 9.3,10.55 | 8.95,12.2 U2.GND4 | U2.7 8.95,12.2 | 27.9,13.75 U1.P$16 | 3.5,16.25 C13.2 | C9.2 24.07,18.02
  Top 0.406: 24.07,18.02 24.07,19.18 24.62,19.73
  Bottom 0.2: v2.6,14.8 2.65,14.75 U$6.IN0 | 6.45,20.1 6.46,20.1 U$3.IN0
  Bottom 0.3: 3,7 3.54,6.46 4.15,6.46 U$4.IN0 | 3,7 3,9.46 U$5.IN0 | U2.GND5 U2.GND | U2.GND2 U2.GND | U2.GND U2.GND3 | U2.GND4 U2.GND | 6.45,20.1 6.45,20.05 v5.75,19.35 | U$2.IN0 11.91,20.14 9.9,22.15 v8.8,21.95 | 3,7 3,6.95 v2.85,6.33 | v21.6,21.4 20.9,21.4 20.75,21.25 20.75,20.25 U$11.P$2
  Bottom 0.305: U$6.IN0 4.6,14.75
  Bottom 0.406: U$25.P$3 26.9,86.1 U$27.P$2
  other vias: 14.5,22 12,39.5 17,51.5 30,49.5 10,49.5 10,59.5 20,59.5 30,59.5 30,69.5 20,69.5 10,69.5 10,79.5 30,79.5 8.6,2.4 4.3,4.1 21.8,10.65 15.7,17.8 5.08,22.13 2.59,13.07 13.15,4.25 22,2.05 21.75,18.7 24.7,33.8 2.6,17.8 6.4,8.3 21.2,18.1 30.1,2.65 32.25,7.2 34,1.8 14.85,7.95 9.7,10.15 7.15,9.25 2.85,8.9 6.75,10.5 19.4,5.65 7.25,24.75 7.25,24 22.1,15.15 22.3,21.9 26.95,22.3 31.1,22.3 36.5,11.45 33.9,19.5 29.35,15.65 34.45,20.85 33.05,20.85 32.8,19.5 25.5,5.5 22,4.05 8.56,30.2 31.89,34.41 16.1,12.75 23.55,20.5 34.8,15.3 29.4,18.05
  pour Bottom (rank 3): 0,0 37.25,0 37.25,25.5 35.55,25.5 35.55,93.5 8.45,93.5 8.45,25.5 0,25.5
  pour Bottom: 0,0 37.25,0 37.25,25.5 35.55,25.5 35.55,93.5 8.45,93.5 8.45,25.5 0,25.5
  pour Top (rank 2): 0,-0.1 37.25,0 37.25,25.5 35.55,25.5 35.55,93.5 8.5,93.4 8.5,25.5 0,25.5
  pour Top (rank 2): 0,0 37.25,0 37.25,25.5 35.55,25.5 35.55,93.5 8.45,93.5 8.45,25.5 0,25.5
  pour Route15: 35.55,93.5 35.55,25.4 37.25,25.4 37.25,0 0,0 0,25.5 8.45,25.5 8.45,93.5
  pour Route2: 35.55,93.5 35.55,25.4 37.25,25.4 37.25,0 0,0 0,25.5 8.45,25.5 8.45,93.5
HVOUT  (via drill 0.3 pad 0.6)  (1 unrouted)
  Top 0.127: U$8.P1 35.85,5.75 35.9,5.75 | C8.1 30.6,16.25 30.53,16.21
  Top 0.15: 35.9,5.3 35.25,4.65 35.25,3.35 v34.9,3
  Top 0.2: 24.8,10.03 C5.1 | 24.8,10.03 24.8,9.9 | 24.8,9.2 24.8,9 25.2,8.6 | 26.6,8.6 U1.13 | 31.7,13.8 U1.36 | U1.7 25.6,11.35 24.8,10.55 24.8,10.03 | U$9.A 20.85,6.4 R11.1 | 35.9,5.75 35.9,5.3 | C9.1 24.05,16.26 24.07,16.28
  Top 0.3: 31.7,14.9 31.7,13.8 | 24.31,9.49 25.2,8.6 | 25.2,8.6 26.6,8.6 | 25.2,8.6 25.2,8.1 v25.7,7.6 | 35.9,5.65 35.9,5.75
  Top 0.305: v32.01,15.17 31.92,15.12 31.7,14.9 30.47,16.13 C8.1 | v21.75,8.3 21.75,7.3 R11.1
  Top 0.4: 24.31,9.49 23.12,8.3 v21.75,8.3
  Top 0.406: C8.1 30.49,16.11 | C5.1 24.31,9.49 | 24.8,9.9 24.8,9.2
  Bottom 0.127: v25.7,7.6 25.6,7.5 25.6,7.55
  Bottom 0.3: 25.7,7.55 25.6,7.55 | 25.9,13.6 25.91,7.56 25.66,7.56 v25.7,7.6
  Bottom 0.305: 25.9,13.6 v25.9,14.4 | v21.75,8.3 21.75,7.25 21.1,6.6 20.15,6.6 20.15,7.6 20.2,7.65
  Bottom 0.4: v32.01,15.17 32.01,8.96 32,8.5 34.9,5.6 v34.9,3
  Bottom 0.406: 32,8.5 27.4,8.5 26.5,7.6 v25.7,7.6
  pour Top (isolate 0.254): 23.55,16.9 23.55,15.55 25.05,14.05 26.8,14.05 26.8,14.85 25.5,14.85 24.55,15.8 24.55,16.9
LVOUT
  Top 0.2: U2.11 C16.1
  Top 0.3: C16.1 10.45,8.8 10.5,8.8 10.5,7.4 12.7,5.2 16,5.2 18.19,3.01 U$16.P$1
N$1
  Top 0.127: 27.1,14.5 U1.47
  Top 0.2: L2.2 25.39,16.11 27.1,15 27.1,14.5
N$2
  Top 0.2: L2.1 L3.2
N$3
  Top 0.2: U1.46 27.5,15.3 27.03,15.93 L3.1 C10.1
N$5
  Top 0.2: 22.84,16.32 C4.1 | U1.1 24.96,13.75 22.94,15.77
  Top 0.3: 22.94,15.77 22.94,16.22 C4.1
N$6
  Top 0.2: U1.35 32.24,13.35 33.29,14.4 33.29,16.44 X1.P1 31.71,16.41 C2.1
N$7
  Top 0.195: 33.94,15.85 33.94,16.95 34.14,17.24
  Top 0.2: U1.34 32.35,12.95 33.94,14.53 33.94,15.85 | 34.14,17.24 34.39,17.63 X1.P3 35.37,17.57 C1.1
N$8
  Top 0.2: U1.30 32.4,11.35 32.44,11.3
  Top 0.3: 32.44,11.3 C3.1
  Top 0.61: C3.1 L1.2
N$9
  Top 0.254: AE1.P$1 36.64,8.2 C11.1
  Top 0.406: L1.1 C11.1
N$10
  Top 0.2: U1.33 32.45,12.55 33.94,14.04 34.61,14.04 C7.1 34.55,14.05
N$11
  Top 0.2: C6.1 34.39,12.69 34.34,12.64 33.07,12.64 32.58,12.15 U1.32
N$12
  Top 0.3: U2.28 8.9,16.05 7.15,16.05 6.3,16.9 5.25,16.9 4.6,17.55
  Top 0.406: L4.PIN2 3.73,18.43 4.6,17.55
N$13
  Top 0.3: U2.27 9.45,16.9 8.75,17.6 8.75,19 C12.1
  Top 0.406: C12.1 7.38,19.05 L4.PIN1
N$14  (via drill 0.3 pad 0.6)
  Top 0.3: U2.22 11.95,16.55 12,16.6 13.55,16.6 14.15,16 15.75,16 16.4,16.65 v16.8,16.65
  Bottom 0.2: R2.2 8.75,8.7 8.75,15.6 9.65,16.5 14.7,16.5 14.95,16.25 16.4,16.25 v16.8,16.65
  Bottom 0.305: R2.2 10.5,6.85 R1.1
N$15
  Top 0.3: U$1.2 6.8,14.7 U2.2
N$16  (via drill 0.3 pad 0.6)
  Top 0.3: U2.23 11.45,16.85 11.7,17.1 13.85,17.1 14.05,16.9 v15.45,16.9
  Bottom 0.2: R3.2 8.85,7.8 8.4,8.25 8.4,15.75 9.5,16.85 15.4,16.85
  Bottom 0.3: 15.4,16.85 v15.45,16.9
  Bottom 0.305: R2.1 10.5,5.3 R3.2
N$17
  Top 0.2: R11.2 22.8,5.55 U$10.4 24,6.8 26.5,6.8 27.9,8.2 U1.16
N$18  (via drill 0.3 pad 0.6)  (1 unrouted)
  Top 0.127: 14.25,17.6 14.25,17.5 14.4,17.6
  Top 0.3: U2.24 10.95,17.1 11.45,17.6 14.25,17.6 v14.35,17.6
  Bottom 0.2: v14.35,17.6 9.7,17.6 8.05,15.95 8.05,7.85 7.2,7
  Bottom 0.3: R4.2 7.45,7.05 7.45,7.15
  Bottom 0.305: R3.1 8.85,5.3 R4.2
N$19  (via drill 0.3 pad 0.6)  (1 unrouted)
  Top 0.2: U2.4 7.4,13.7 5.6,11.9 v5.6,10.9
  Bottom 0.2: v5.6,10.9 5.6,8.5 5.1,8
N$20  (via drill 0.3 pad 0.6)
  Top 0.3: U2.18 14,13.7 v14.1,13.8
  Bottom 0.3: v14.1,13.8 14.1,14.95 14.75,15.6 16.85,15.6 17.8,16.55 17.8,16.85 16.05,18.6 8.8,18.6 8.25,19.15 8.24,19.15 U$3.OUT
N$21
  Top 0.15: 34.6,4.4 35.25,5.12 35.25,6.1 32,9.35
  Top 0.2: U$8.P4 34.6,4.4 | 32,9.35 U1.25
N$22
  Top 0.2: U$8.P3 34.6,6.1 32.05,8.65 U1.24
N$23  (via drill 0.3 pad 0.6)
  Top 0.3: U2.12 10.95,9.9 11.5,9.35 11.5,8.35 12.05,7.8 v13.28,6.6
  Bottom 0.3: U$2.OUT 15.89,19.1 16.3,19.1 18.3,17.1 18.3,16.25 17.15,15.1 15.45,15.1 14.7,14.35 14.7,12.45 13.95,11.7 13.93,9.65 13.28,9 v13.28,6.6
N$24
  Top 0.15: 35.87,4.52 36.27,5.03 36.4,5.3 36.65,5.8 36.9,6.6
  Top 0.2: U$8.P2 35.87,4.52 | 36.9,6.6 36.35,7.15 34.8,7.15 32.25,9.75 U1.26
N$25
  Top 0.2: U$8.P6 32.7,5 31.6,5 30.7,5.9 30.7,7.2 29.9,8 U1.21
N$26  (via drill 0.3 pad 0.6)  (1 unrouted)
  Top 0.2: U2.5 7.5,13.2 6.7,12.4 v6.7,12.15
  Bottom 0.2: v6.7,12.15 6.6,12.15 6.45,12.3 5.1,12.3
N$27  (via drill 0.3 pad 0.6)
  Top 0.2: U2.6 7.7,12.7 7.4,12.4 v7.4,11.65
  Bottom 0.2: U$6.OUT 7.4,14.21 v7.4,11.65
N$28  (via drill 0.3 pad 0.6)
  Top 0.2: v13.95,8.45 13.1,8.45 11.45,10.1 U2.13
  Bottom 0.305: R6.1 R5.1 13.97,6.35 13.97,8.43 v13.95,8.45
N$29
  Top 0.127: 8,36.3 6.75,35.25 7.95,35.85 8.15,37.15
  Top 0.15: 10.81,29.5 10.81,28.75 | 11.94,29.5 11.94,28.75 | 10.81,24 10.81,23.25 | 11.94,24 11.94,23.25
  Top 0.2: 10.81,29.5 10.88,30.75 11.38,30.75 11.88,30.75 11.94,29.5 | 10.81,28.75 10.81,24 | 11.94,28.75 11.94,24 | 12.75,21.5 12.75,21.3 R10.1
  Top 0.3: U2.25 10.45,17.35 11.2,18.1 13.55,18.1 13.95,18.5 13.95,20.25 13.3,20.9 13.05,20.9 R10.1
  Top 0.4: U$39.P$1 13.11,30.07 11.38,31.8
  Top 1.2: 11.38,30.75 11.38,31.8 11.38,36.3
  Top 1.27: 8.9,36.25 8.15,37.15
  Top 1.5: 8,36.3 11.38,36.3 36,36.3
  pour Top: 10.8,23.4 12.95,23.4 12.95,24.1 13.2,24.1 13.2,21.6 13,21.4 12.6,21.4 10.8,23.2
N$30
  Top 0.305: R12.1 18.55,6.38 U$9.C
N$31  (via drill 0.3 pad 0.6)
  Top 0.2: v31.35,7.05 30.3,8.1 U1.22
  Top 0.4: v27.4,5.45 27.4,4.95 25.3,2.85 22.1,2.85 R12.2
  Bottom 0.305: v27.4,5.45 29.85,5.45 v31.35,7.05
N$32
  Top 0.127: 10.15,19.15 10.25,19.25 R9.1
  Top 0.3: U2.26 9.95,18.95 10.15,19.15
  Top 0.813: R9.1 R10.2
N$33
  cutout Route2: 8,25.5 12.5,25.5 12.5,28 8,28
  cutout Route2: 31.5,25.5 36,25.5 36,28 31.5,28
N$34  (via drill 0.3 pad 0.6)
  Top 0.305: U2.14 12,11.35 C15.1 13.5,11.35 v14.95,9.9
  Bottom 0.3: R6.2 18,5.58 18,4.8 15.66,2.46 U$37.P$1
  Bottom 0.305: v14.95,9.9 14.96,9.38 | 14.96,9.38 14.97,9 R6.2 | U$31.IN0 14.99,9.36 14.96,9.38
N$35
  cutout Route15: 8,28 12.5,28 12.5,25.5 8,25.5
N$36
  pour Top: 26.4,13.45 24.65,13.45 23.45,14.65 21.5,14.65 21.5,13.95 21.2,13.65 20.2,13.65 20.2,12.97 21.5,12.97 21.8,13.28 26.4,13.28
N$37
  Top 0: 24.45,12.95 23.4,12.95 23.2,12.75 22.5,12.75 22.45,12.7 | 22.45,11.69 X2.P$2
  Top 0.2: 24.45,12.95 U1.3
  pour Top (rank 2): 24.45,12.95 21.95,12.95 20.45,11.45 22.95,11.45
N$38  (via drill 0.3 pad 0.6)
  Top 0.2: U1.4 24.8,12.55 v24.65,12.4
  Bottom 0.3: 20.75,4 22.8,6.05 22.8,6.4
  Bottom 0.305: v24.65,12.4 23.8,12.4 22.8,11.4 22.8,6.4 | 20.75,4 U$20.P$1
N$39
  cutout Route15: 31.5,28 36,28 36,25.5 31.5,25.5
N$40
  Bottom 0: 37.25,25.5 35.55,25.5 35.55,93.5
N$42  (via drill 0.3 pad 0.6)
  Top 0.2: U1.5 25.2,12.15 24.9,11.85 24.2,11.85 v24,11.65
  Bottom 0.3: 23.6,5.6 23.6,1.53 U$21.P$1
  Bottom 0.305: v24,11.65 24,11.6 23.6,11.2 23.6,5.6
N$43  (via drill 0.3 pad 0.6)
  Top 0.2: U1.6 25.35,11.75 24.85,11.25 24.7,11.25 v24.35,10.9
  Bottom 0.3: 24.35,3.95 25.81,2.49 U$22.P$1
  Bottom 0.305: v24.35,10.9 24.35,3.95
N$45
  Bottom 0.305: U$31.OUT 20.2,11.05 U$32.P$2 19.95,8.28 RTEST.2
N$46  (via drill 0.3 pad 0.6)
  Top 0.305: v17.15,10.2 17.9,9.45 18,9.45 U$33.3
  Bottom 0.305: U$31.IN1 17.74,12.89 17.15,12.3 v17.15,10.2
N$47
  Top 0.305: R7.1 18.88,11.47 U$33.1 19.4,10.95 19.4,8.5 18.85,7.95 17.5,7.95 16.75,8.7 U$7.3
N$48
  cutout Top: 8,25.5 8,23.25 10.5,23.25 10.5,25.5
N$49
  cutout Top: 8,27.75 10.5,27.75 10.5,29.75 8,29.75
PRIM
  Top 0.3: U2.17 14.5,13.2 15.3,14 17.3,14 19.4,16.1 19.4,20.15 21.75,22.5 24.06,22.5 U$12.P$1
STATUS0  (via drill 0.3 pad 0.6)  (1 unrouted)
  Top 0.3: 12.7,15.2 U2.21 13.2,15.2 13.5,15.5 16.7,15.5 17.4,16.2 17.4,23.46 U$15.P$1
  Top 0.305: 15.22,6.67 14.07,6.67 v12.5,8.25 | v12.8,15.8 12.8,15.25 U2.21
  Bottom 0.305: v12.5,8.25 12.5,8.9 13.45,9.85 13.45,15.15 v12.8,15.8
STATUS1
  Top 0.3: U2.20 13.4,14.7 13.7,15 16.9,15 17.9,16 17.9,21.42 U$14.P$1
STATUS2
  Top 0.3: U2.19 13.6,14.2 13.9,14.5 17.1,14.5 18.4,15.8 18.4,19.8 21.7,23.1 22.9,23.1 23.2,23.4 23.2,24.18 U$13.P$1
VBOOST  (via drill 0.3 pad 0.6)
  Top 0.127: 5.5,16 5,16.5 4.95,16.45
  Top 0.3: U2.1 6.95,15.2 6.15,16 5.5,16 C13.1 | 5,16.4 4.95,16.45 4.5,16.9 2.7,16.9 1.8,16 1.8,5.9 2.6,5.1 v5.6,5.1
  Bottom 0.127: R4.1 7.25,5 7.2,5
  Bottom 0.3: v5.6,5.1 7.1,5.1 7.2,5 7.2,5.1
VBUCK  (via drill 0.3 pad 0.6)  (1 unrouted)
  Top 0.3: U$1.1 5.95,12.9 6.6,13.6 | U2.3 7.2,14.2 6.6,13.6 | 6.6,13.6 5.8,13.6 v5.5,13.9
  Top 0.305: C14.1 4.6,10.4 v4.9,10.1
  Top 0.406: U$1.1 C14.1
  Bottom 0.2: 15.21,20.15 U$2.IN1 | v4.9,10.1 4.5,10.1 U$4.IN1
  Bottom 0.3: v5.5,13.9 5.36,14.04 U$5.IN1 1.96,14.04 1.45,14.55 1.45,17.95 2.64,19.14 4.15,19.14 | U$3.IN1 9.95,20.1 10.4,20.55 10.4,20.9 10.05,21.25 6.3,21.25 | 6.3,21.25 6,21.25 4.15,19.4 4.15,19.14 | 4.15,19.14 4.15,18.25 U$6.IN1 | 6.3,21.25 7.75,22.7 14.65,22.7 15.5,22 15.5,20.25 15.4,20.15 15.21,20.15
  Bottom 0.406: 4.15,18.25 4.15,18.1

### Text on the board
tPlace: Indoor Solar Reference Design / w/ Nordic BLE and E-peas Energy Harvester | PowerFilm Solar | REF-IN-BLE-NS 4-1 | R9 | R10 | AEM10941 | LED3 | NRF52832 | nRF Blinky | REF-IN-BLE-NS 4-1 | PowerFilm Solar | BUTTON1
bPlace: + | - | + | + | BAL | BAL | BAL | BAL | BAL | GND | BAL | BATT | SOL | BATT | SOL | GND | S0 | S1 | S2 | PR | BAL | ENBAL | CFG0 | ENLV | ENHV | CFG1 | PWRSRC | CFG2 | R5 | R6 | ENNRF | RTEST | R4 | R3 | R2 | R1 | HV | LV | P2 | P3 | P4 | GND
tNames: U1